# EAGLE design uc4h airspeed v0401 addonrscspi1 (EAGLE 7.5.0)
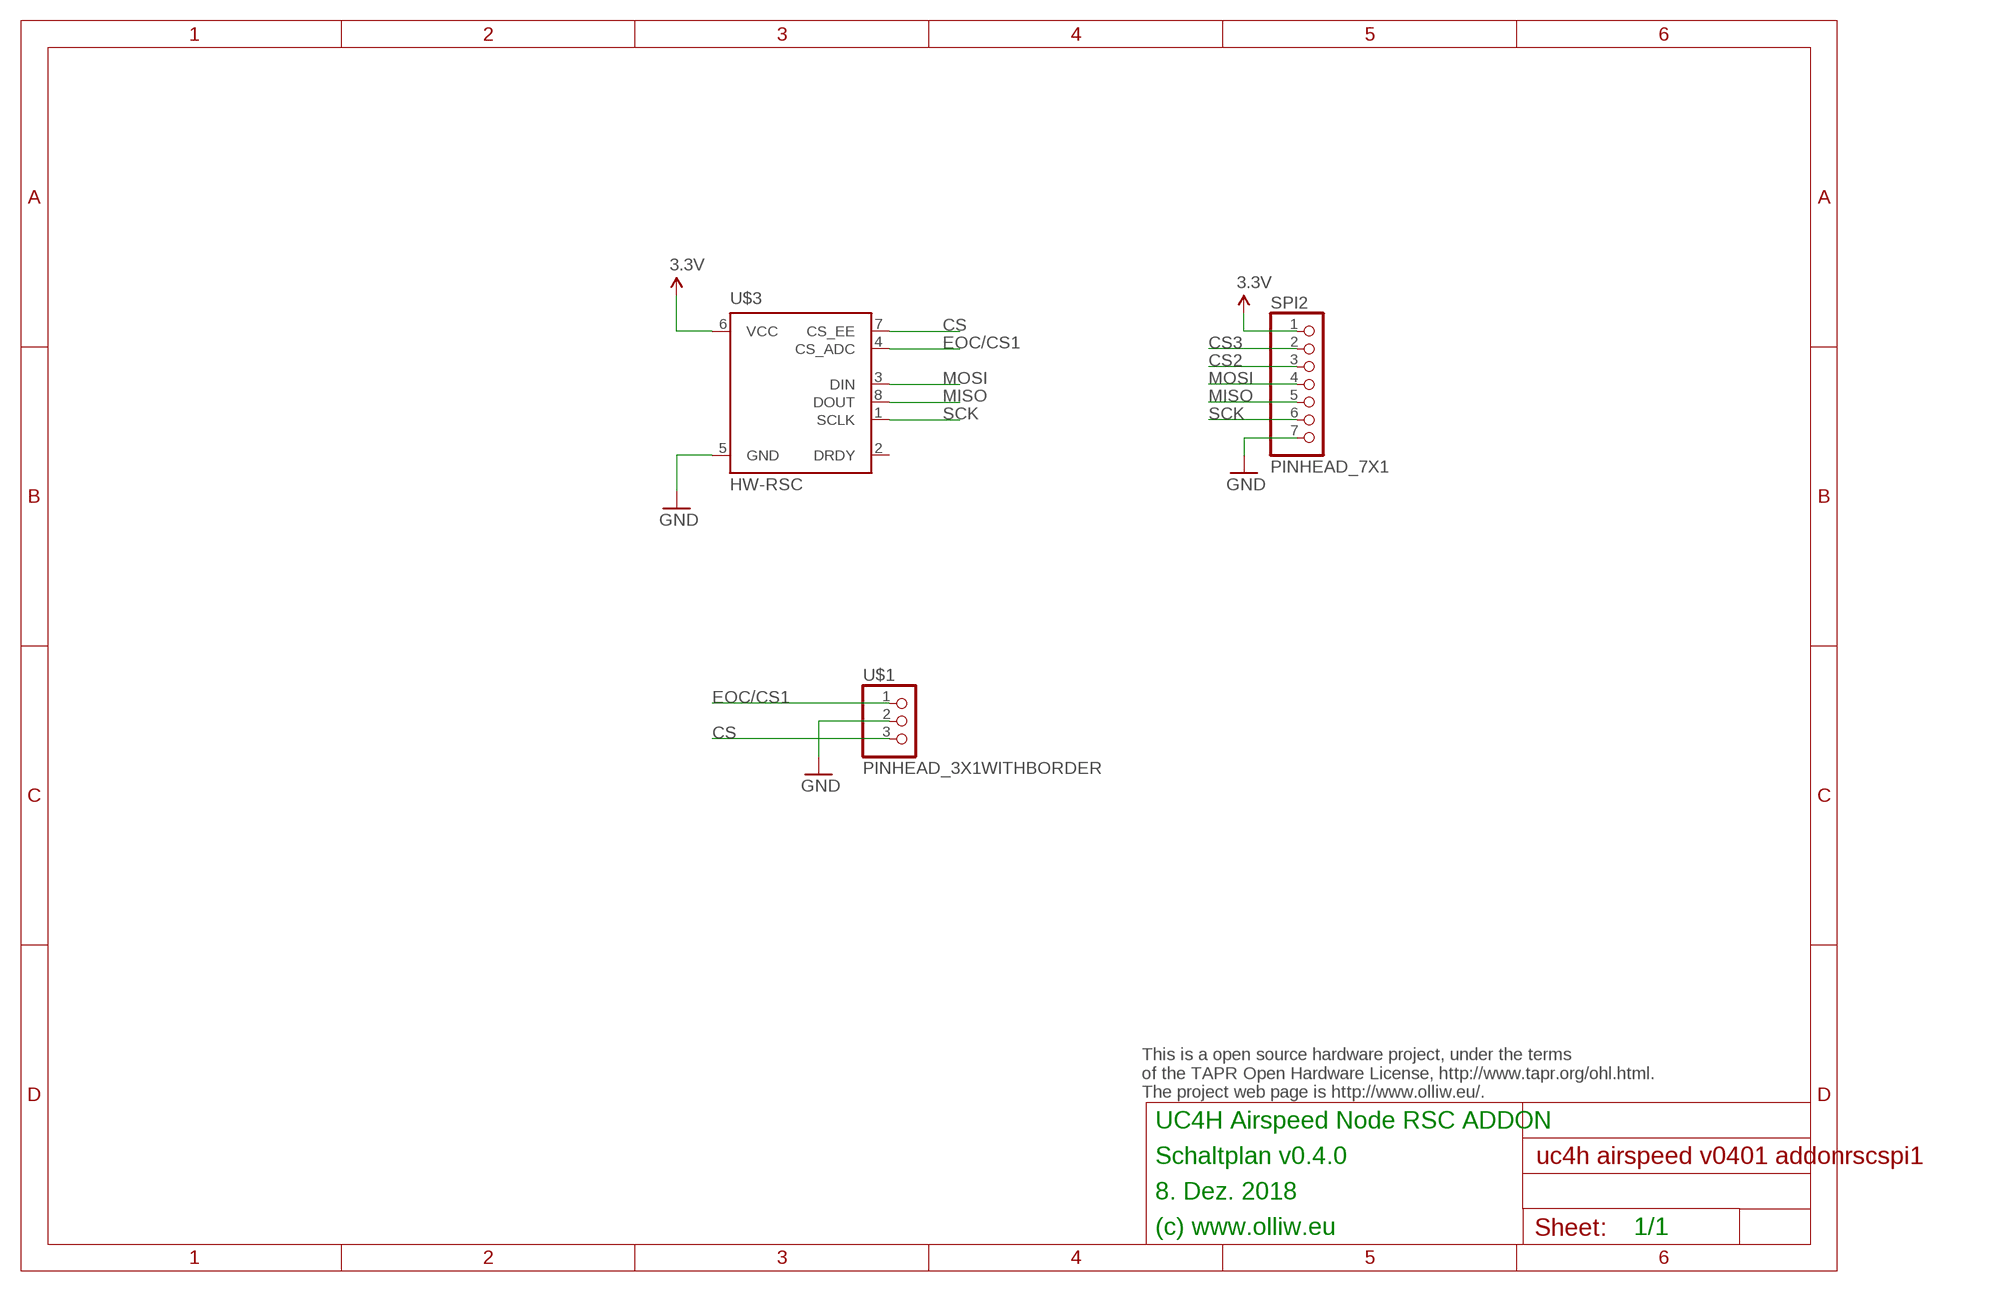
[diagram p0: schematic, sheet 1]

## Parts
SPI2  PINHEAD_7X1  [PINHEAD_7X1]
U$1  PINHEAD_3X1WITHBORDER  [PINHEAD_3X1]
U$3  HW-RSC  [HONEYWELL-8]

## Nets
3.3V: SPI2.1 U$3.6(VCC)
CS: U$1.3 U$3.7(CS_EE)
CS2: SPI2.3
CS3: SPI2.2
EOC/CS1: U$1.1 U$3.4(CS_ADC)
GND: SPI2.7 U$1.2 U$3.5(GND)
MISO: SPI2.5 U$3.8(DOUT)
MOSI: SPI2.4 U$3.3(DIN)
SCK: SPI2.6 U$3.1(SCLK)
Unconnected: U$3.2(DRDY)

## Notes on the sheet
- This is a open source hardware project, under the terms
  of the TAPR Open Hardware License, http://www.tapr.org/ohl.html.
  The project web page is http://www.olliw.eu/.
- UC4H Airspeed Node RSC ADDON
- Schaltplan v0.4.0
- 8. Dez. 2018
- (c) www.olliw.eu | 1/1

## Library data of the parts
SPI2 = # stdlib:PINHEAD_7X1
U$1 = # stdlib:PINHEAD_3X1
U$3 = # stdlib:HW-RSC

## Board
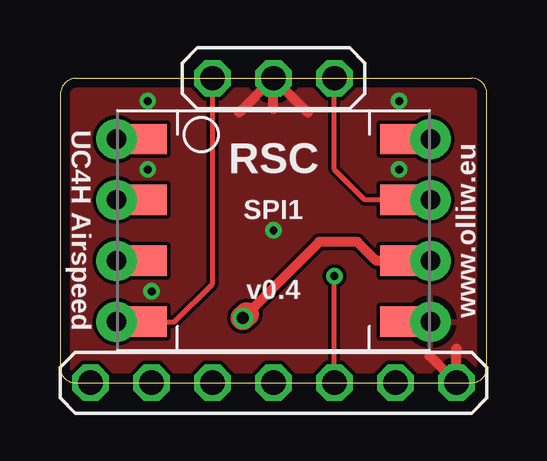
[diagram p1: board, top side]
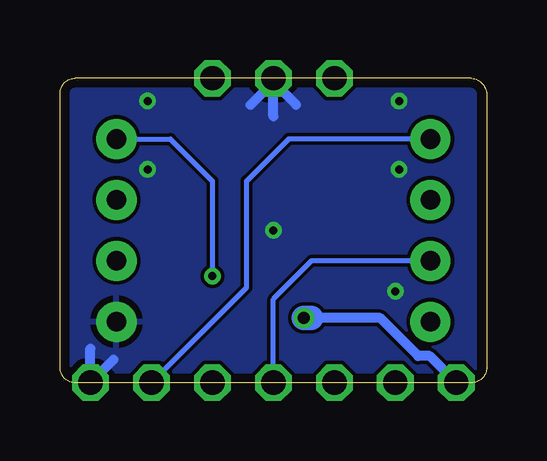
[diagram p2: board, bottom side, seen from below]

Size 17.78 x 12.7 mm. Coordinates in mm from the lower left corner, seen from the top.
Outline: 0.64,0 17.15,0 arc90 17.78,0.63 17.78,12.07 arc90 17.15,12.7 0.64,12.7 arc90 0,11.91 0,0.63 arc90 0.64,0
Copper layers (1*16): Top 0.0356mm / dielectric 1.5011mm / Bottom 0.0356mm
Design rules "ow-oshpark-2layer": minimum track width 6mil, minimum drill 13mil, track to track 6mil, track to pad 6mil, pad to pad 6mil, via to via 6mil, smd to smd 6mil, copper to edge 15mil, drill to drill 6mil, minimum pad ring 7mil, minimum via ring 7mil, stop-mask expansion 2.5mil, vias tented up to drill 26mil, thermal gap 10mil

### Footprints (pad centres in the part's own frame; a part is rotated, then mirrored left to right if it is on the bottom)
PINHEAD_7X1 = drill 1.016 octagon: 1 0,0; 2 0,-2.54; 3 0,-5.08; 4 0,-7.62; 5 0,-10.16; 6 0,-12.7; 7 0,-15.24
PINHEAD_3X1 = drill 1.016 octagon: 1 0,0; 2 0,-2.54; 3 0,-5.08
HONEYWELL-8 = drill 0.813 pad 1.676: 1 -6.54,3.81; 2 -6.54,1.27; 3 -6.54,-1.27; 4 -6.54,-3.81; 5 6.54,-3.81; 6 6.54,-1.27; 7 6.54,1.27; 8 6.54,3.81 | smd 2.54 x 1.27: P$9 -5.715,3.81; P$10 -5.715,1.27; P$11 -5.715,-1.27; P$12 -5.715,-3.81; P$13 5.715,-3.81; P$14 5.715,-1.27; P$15 5.715,1.27; P$16 5.715,3.81

### Placement (x,y rotation side)
SPI2  1.27,0 90 top
U$1  6.35,12.7 90 top
U$3  8.89,6.35 0 top

### Tracks (layer width: path | path; a pad name or v marks a point on that pad's centre or on a via)
3.3V  (via drill 0.5)
  Top 0.406: U$3.6 13.18,5.08 12.39,5.87 10.8,5.87 7.78,2.86
  Top 1.016: 7.78,2.86 v7.62,2.7
  Bottom 0.406: 7.31,2.7 4.45,2.7 2.86,1.11 2.39,1.11 SPI2.1
  Bottom 1.016: v7.62,2.7 7.31,2.7
CS
  Top 0.203: U$3.7 12.7,7.62 11.43,8.89 U$1.3
EOC/CS1
  Top 0.203: U$3.4 4.77,2.54 6.35,4.13 U$1.1
GND  (via drill 0.33)
  Top 0.406: 16.51,1.43 SPI2.7 15.4,1.11 | U$1.2 10.32,11.27 | 7.47,11.27 U$1.2 | 8.89,11.43 U$1.2
  Bottom 0.406: 15.56,0.95 SPI2.7 16.51,1.43 | 8.89,11.11 8.89,12.54 | 9.85,11.59 8.89,12.54 | 8.89,12.54 7.94,11.59
  other vias: 14.13,8.89 3.66,8.89 3.81,3.81 3.66,11.75 14.13,11.75 8.89,6.35
  pour Bottom (isolate 0.152, rank 6): 0.48,12.7 17.31,12.7 17.31,-0.16 0.48,-0.16
  pour Top (isolate 0.152, rank 6): 0.48,12.7 17.31,12.7 17.31,-0.16 0.48,-0.16
MISO  (via drill 0.33)
  Top 0.203: SPI2.5 v11.43,4.45
  Bottom 0.203: U$3.8 13.18,10.16 11.43,8.41 v11.43,4.45
MOSI
  Bottom 0.203: SPI2.4 8.89,3.49 7.31,5.08 U$3.3
SCK
  Bottom 0.203: SPI2.6 10.01,3.97 10.01,8.41 8.26,10.16 U$3.1

### Text on the board
tNames: RSC | UC4H Airspeed | SPI1 | www.olliw.eu | v0.4